# Altium schematic sheet eMMCChip.SchDoc
size A3; SheetNumber: 7; SheetTotal: 22
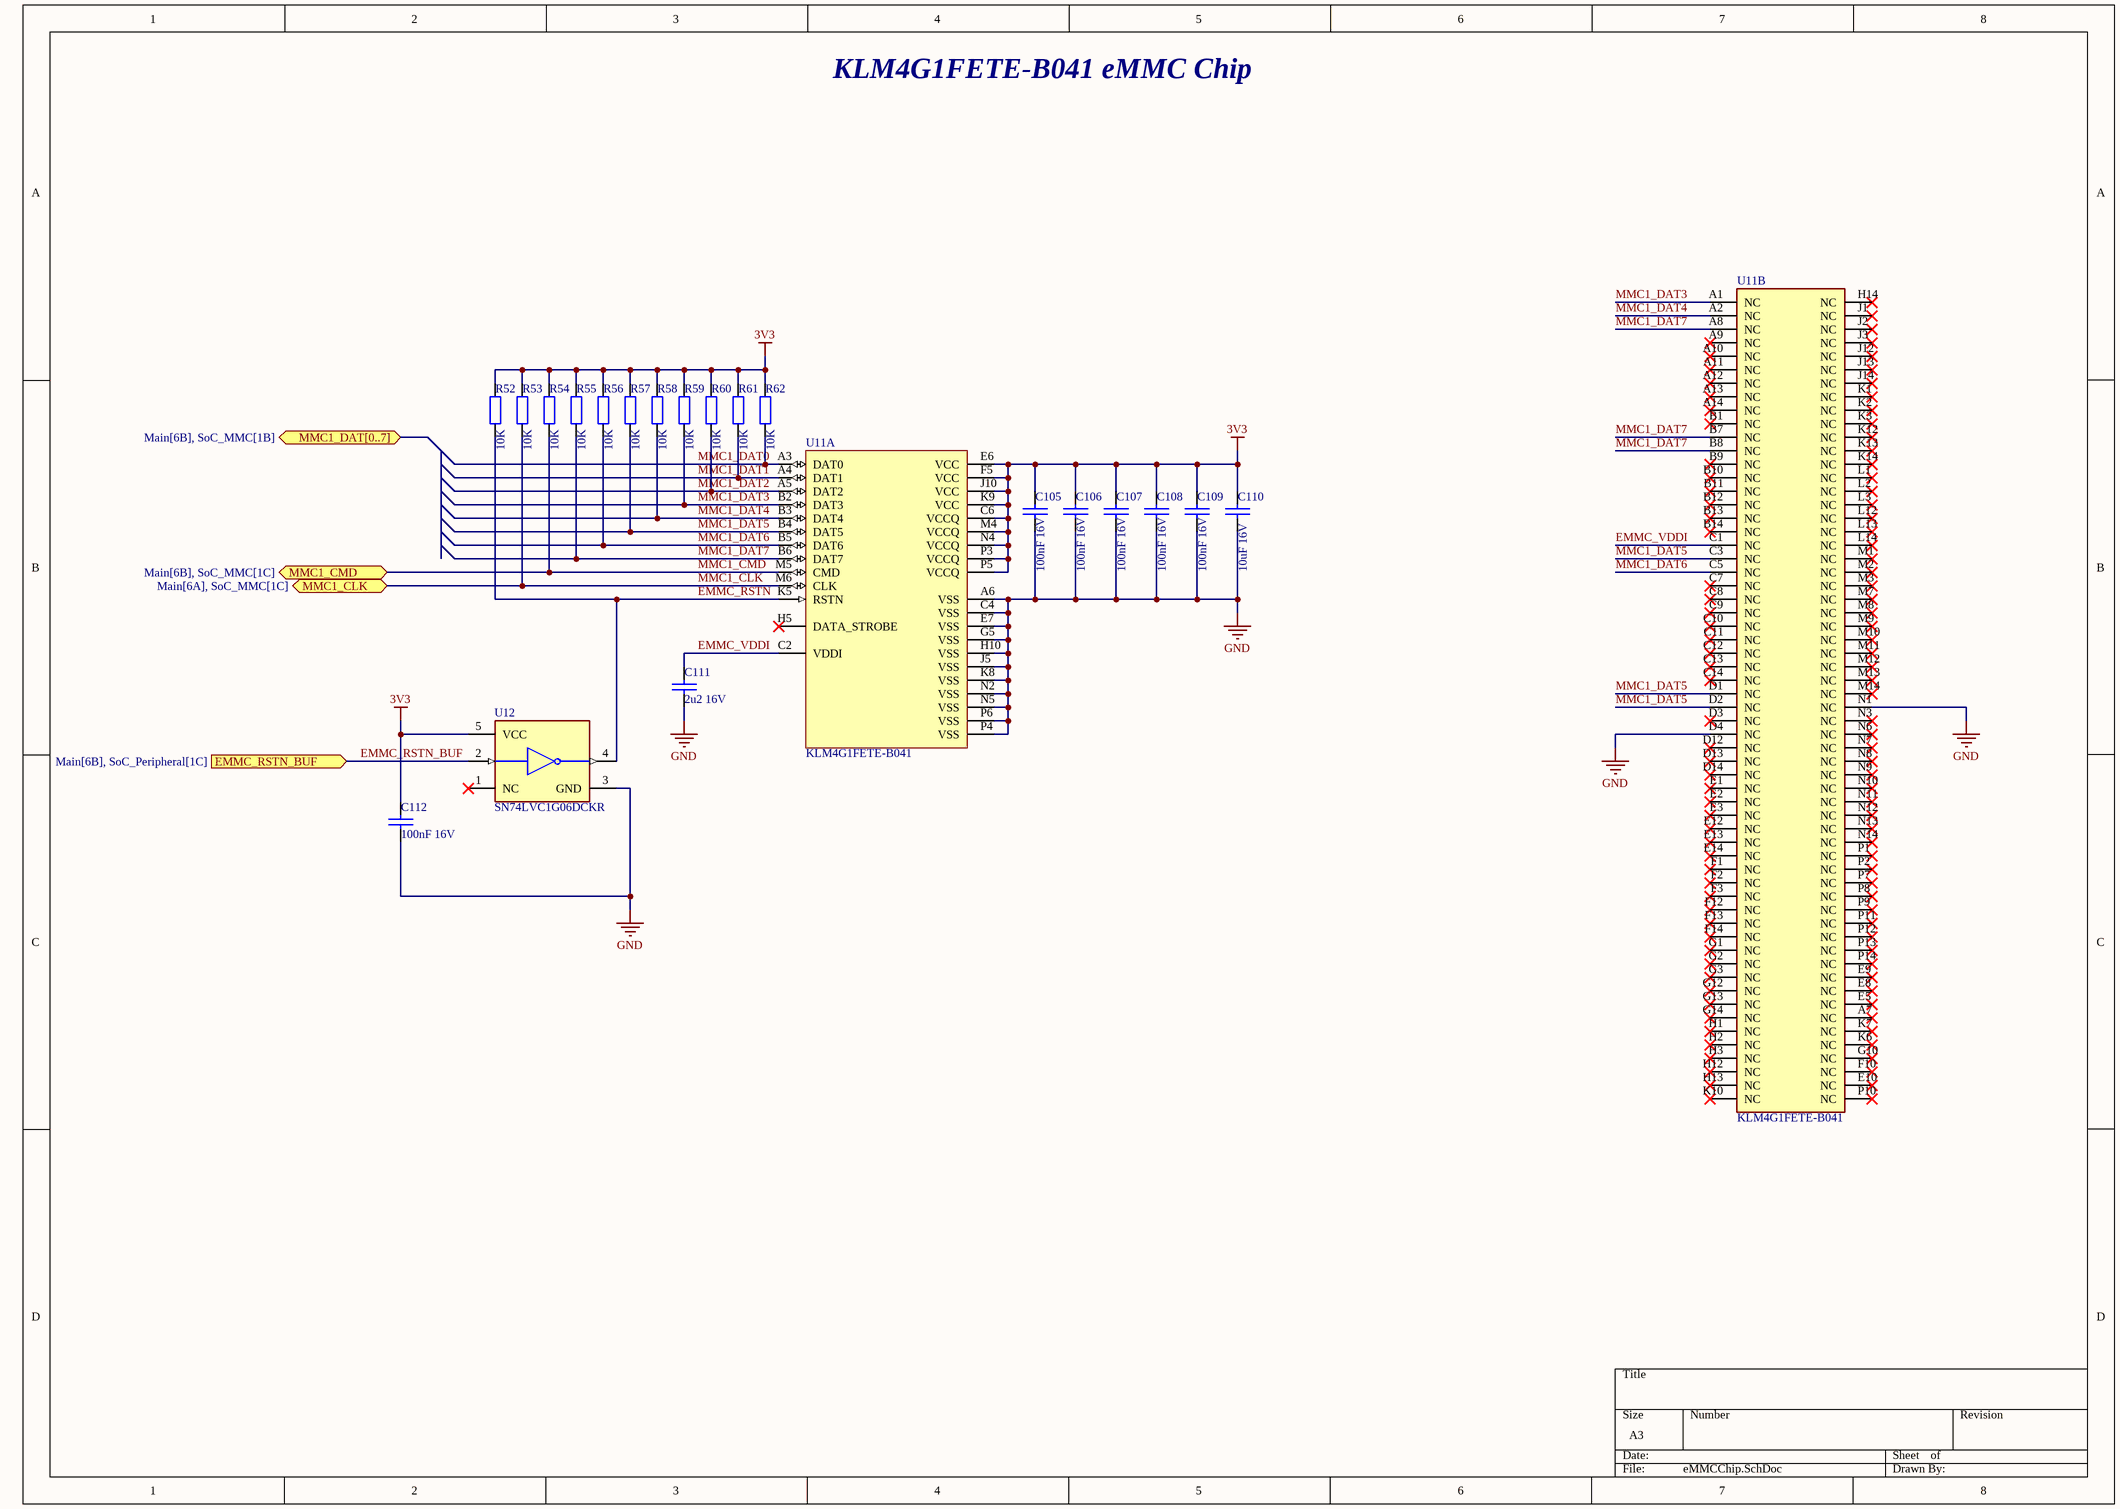
[diagram p0: eMMCChip.SchDoc]

## Parts
C105  100nF 16V  [C_0402]
C106  100nF 16V  [C_0402]
C107  100nF 16V  [C_0402]
C108  100nF 16V  [C_0402]
C109  100nF 16V  [C_0402]
C110  10uF 16V  [C_0603]
C111  2u2 16V  [C_0402]
C112  100nF 16V  [C_0402]
R52  10K  [R_0402]
R53  10K  [R_0402]
R54  10K  [R_0402]
R55  10K  [R_0402]
R56  10K  [R_0402]
R57  10K  [R_0402]
R58  10K  [R_0402]
R59  10K  [R_0402]
R60  10K  [R_0402]
R61  10K  [R_0402]
R62  10K  [R_0402]
U11  KLM4G1FETE-B041  [BGA153C50P14X14_1100X1000X80]  (parts A,B of 2)
U12  SN74LVC1G06DCKR  [FP-DCK0005A-MFG]

## Ports
EMMC_RSTN_BUF (in, see Main[6B], SoC_Peripheral[1C]), MMC1_CLK (bidir, see Main[6A], SoC_MMC[1C]), MMC1_CMD (bidir, see Main[6B], SoC_MMC[1C]), MMC1_DAT[0..7] (bidir, see Main[6B], SoC_MMC[1B])

## Nets
3V3: C105.1 C106.1 C107.1 C108.1 C109.1 C110.1 C112.1 R52.2 R53.2 R54.2 R55.2 R56.2 R57.2 R58.2 R59.2 R60.2 R61.2 R62.2 U11.C6(VCCQ) U11.E6(VCC) U11.F5(VCC) U11.J10(VCC) U11.K9(VCC) U11.M4(VCCQ) U11.N4(VCCQ) U11.P3(VCCQ) U11.P5(VCCQ) U12.5(VCC)
GND: C105.2 C106.2 C107.2 C108.2 C109.2 C110.2 C111.2 C112.2 U11.A6(VSS) U11.C4(VSS) U11.D4(NC) U11.E7(VSS) U11.G5(VSS) U11.H10(VSS) U11.J5(VSS) U11.K8(VSS) U11.N1(NC) U11.N2(VSS) U11.N5(VSS) U11.P4(VSS) U11.P6(VSS) U12.3(GND)
EMMC_RSTN: R52.1 U11.K5(RSTN) U12.4(Y)
EMMC_RSTN_BUF: U12.2(A) ; port EMMC_RSTN_BUF
EMMC_VDDI: C111.1 U11.C1(NC) U11.C2(VDDI)
MMC1_CLK: R53.1 U11.M6(CLK) ; port MMC1_CLK
MMC1_CMD: R54.1 U11.M5(CMD) ; port MMC1_CMD
MMC1_DAT0: R62.1 U11.A3(DAT0)
MMC1_DAT1: R61.1 U11.A4(DAT1)
MMC1_DAT2: R60.1 U11.A5(DAT2)
MMC1_DAT3: R59.1 U11.A1(NC) U11.B2(DAT3)
MMC1_DAT4: R58.1 U11.A2(NC) U11.B3(DAT4)
MMC1_DAT5: R57.1 U11.B4(DAT5) U11.C3(NC) U11.D1(NC) U11.D2(NC)
MMC1_DAT6: R56.1 U11.B5(DAT6) U11.C5(NC)
MMC1_DAT7: R55.1 U11.A8(NC) U11.B6(DAT7) U11.B7(NC) U11.B8(NC)

Not connected (* = marked no-connect by the designer): U11 A7(NC)* A9(NC)* A10(NC)* A11(NC)* A12(NC)* A13(NC)* A14(NC)* B1(NC)* B9(NC)* B10(NC)* B11(NC)* B12(NC)* B13(NC)* B14(NC)* C7(NC)* C8(NC)* C9(NC)* C10(NC)* C11(NC)* C12(NC)* C13(NC)* C14(NC)* D3(NC)* D12(NC)* D13(NC)* D14(NC)* E1(NC)* E2(NC)* E3(NC)* E5(NC)* E8(NC)* E9(NC)* E10(NC)* E12(NC)* E13(NC)* E14(NC)* F1(NC)* F2(NC)* F3(NC)* F10(NC)* F12(NC)* F13(NC)* F14(NC)* G1(NC)* G2(NC)* G3(NC)* G10(NC)* G12(NC)* G13(NC)* G14(NC)* H1(NC)* H2(NC)* H3(NC)* H5(DATA_STROBE)* H12(NC)* H13(NC)* H14(NC)* J1(NC)* J2(NC)* J3(NC)* J12(NC)* J13(NC)* J14(NC)* K1(NC)* K2(NC)* K3(NC)* K6(NC)* K7(NC)* K10(NC)* K12(NC)* K13(NC)* K14(NC)* L1(NC)* L2(NC)* L3(NC)* L12(NC)* L13(NC)* L14(NC)* M1(NC)* M2(NC)* M3(NC)* M7(NC)* M8(NC)* M9(NC)* M10(NC)* M11(NC)* M12(NC)* M13(NC)* M14(NC)* N3(NC)* N6(NC)* N7(NC)* N8(NC)* N9(NC)* N10(NC)* N11(NC)* N12(NC)* N13(NC)* N14(NC)* P1(NC)* P2(NC)* P7(NC)* P8(NC)* P9(NC)* P10(NC)* P11(NC)* P12(NC)* P13(NC)* P14(NC)*; U12 1(NC)*

## Notes on the sheet
- KLM4G1FETE-B041 eMMC Chip

## Library data of the parts
C105-C109 C111 C112 = C_0402: Capacitor 0402 SMD
C110 = C_0603: Capacitor 0603 SMD
R52-R62 = R_0402: Resistor 0402 SMD
U11 = KLM4G1FETE-B041: 4GB 300/19 MB/s eMMC 5.1 FBGA-153(10x11) eMMC ROHS; Manufacturer: Samsung; Manufacturer Part Number: KLM4G1FETE-B041; Datasheet Link: https://www.lcsc.com/datasheet/lcsc_datasheet_2410121848_Samsung-KLM4G1FETE-B041_C500273.pdf
U12 = CMP-0859-00246-4: IC BUFFER INVERT 5.5V SC70-5; Manufacturer: Texas Instruments; Standoff Height: 0mm; Number Of Inputs: 1; Logic Function Desc: Inverting; Min Supply Voltage: 1.65V; Nominal Supply Current: 10uA; Max Junction Temp: +150°C; Propagation Delay: 3.5ns; Manufacturer Part Number: SN74LVC1G06DCKR; Temperature Range High: +125°C; Mouser Description: Buffers & Line Drivers Single Invert w/OD; ComponentLink2URL: http://www.ti.com/lit/ds/symlink/sn74lvc1g06.pdf; Device Class L3: Buffers; Ambient Temperature Range High: +125°C; Temperature: -40°C to +125°C; Automotive: No; RoHS: TRUE; ComponentLink2Description: Datasheet; Ambient Temperature Range Low: -40°C; Lead Free: Yes; Digikey Description: IC BUFFER INVERT 5.5V SC70-5; Number Of Circuits: 1; Package: DCK0005A; Octopart: https://octopart.com/sn74lvc1g06dckr-texas+instruments-465505; Max Supply Voltage: 5.5V; Height: 1.1mm; Number Of Outputs: 1; Device Class L2: Logic ICs; Device Class L1: Integrated Circuits (ICs); Category: IC; Temperature Range Low: -40°C